# EAGLE design NCP1200 (EAGLE 7.7.0)
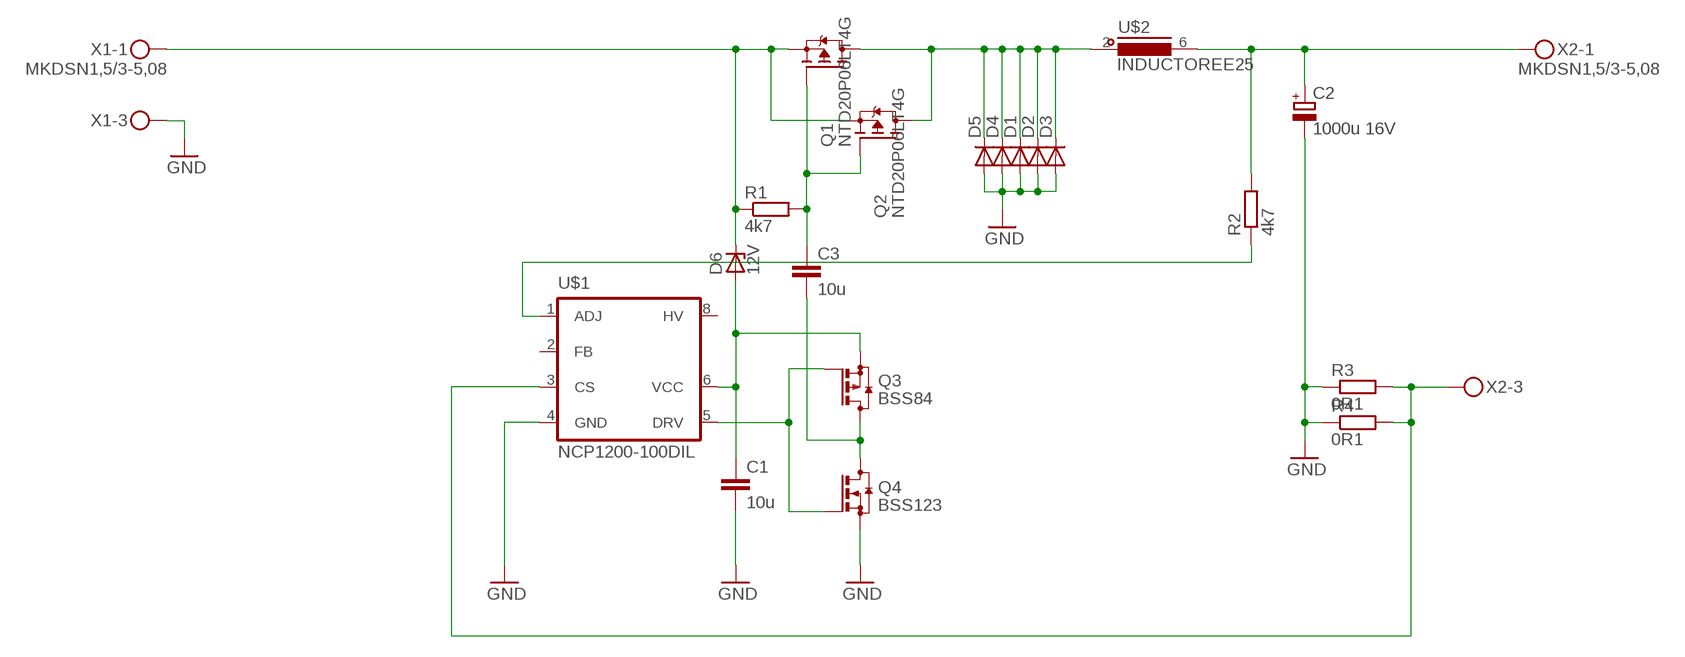
[diagram p0: schematic, sheet 1]

## Parts
C1  10u  C-EUC1210  [C1210]
C2  1000u 16V  CPOL-EUE3.5-8  [E3,5-8]
C3  10u  C-EUC1210  [C1210]
D1  DIODE-DO-214AC  [DO-214AC]
D2  DIODE-DO-214AC  [DO-214AC]
D3  DIODE-DO-214AC  [DO-214AC]
D4  DIODE-DO-214AC  [DO-214AC]
D5  DIODE-DO-214AC  [DO-214AC]
D6  12V  ZENER-DIODESOD80C  [SOD80C]
Q1  NTD20P06LT4G  FDD4141TO252  [TO252]
Q2  NTD20P06LT4G  FDD4141TO252  [TO252]
Q3  BSS84  [SOT23]
Q4  BSS123  [SOT23]
R1  4k7  R-EU_R0805  [R0805]
R2  4k7  R-EU_R0805  [R0805]
R3  0R1  R_SQP-10  [SQP-10]
R4  0R1  R_SQP-10  [SQP-10]
U$1  NCP1200-100DIL  [DIP08]
U$2  INDUCTOREE25  [EE25_8PIN_HORIZ]
X1  MKDSN1,5/3-5,08  [MKDSN1,5/3-5,08]
X2  MKDSN1,5/3-5,08  [MKDSN1,5/3-5,08]

## Nets
GND: C1.2 C2.- D1.A D2.A D3.A D4.A D5.A Q4.2(S) R3.P$1 R4.P$1 U$1.4(GND) X1.3
N$1: D6.C Q1.2(S) Q2.2(S) R1.1 X1.1
N$2: C1.1 D6.A Q3.2(S) U$1.6(VCC)
N$3: D1.C D2.C D3.C D4.C D5.C Q1.3(D) Q2.3(D) U$2.2
N$4: C3.1 Q1.1(G) Q2.1(G) R1.2
N$5: R2.1 U$1.1(ADJ)
N$6: Q3.1(G) Q4.1(G) U$1.5(DRV)
N$7: R3.P$2 R4.P$2 U$1.3(CS) X2.3
N$9: C2.+ R2.2 U$2.6 X2.1
N$10: C3.2 Q3.3(D) Q4.3(D)
Unconnected: U$1.2(FB) U$1.8(HV) X1.2 X2.2

## Library data of the parts
C1 C3 = rcl:C-EU: CAPACITOR, European symbol
C2 = rcl:CPOL-EU: POLARIZED CAPACITOR, European symbol
D1-D5 = diode:DIODE-: DIODE
D6 = diode:ZENER-DIODE: Z-Diode
Q1 Q2 = transistor-fet:FDD4141: P-Channel PowerTrench® MOSFET Source: FDD4141.pdf
Q3 = transistor-small-signal:BSS84: P-CHANNEL MOS FET
Q4 = transistor-small-signal:BSS123: N-CHANNEL MOS FET
R1 R2 = rcl:R-EU_: RESISTOR, European symbol
R3 R4 = Namenlos:R_SQP-10
U$1 = NCP1200:NCP1200-100
U$2 = _Transformers:INDUCTOR
X1 X2 = Namenlos:MKDSN1,5/3-5,08: MKDSN 1,5/ 3-5,08 Printklemme Nennstrom: 13,5 A Nennspannung: 250 V Rastermaß: 5,08 mm Polzahl: 3 Anschlussart: Schraubanschluss Montage: Löten Anschlussrichtung Leiter/Platine: 0 ° Artikelnummer: 1729131 Source: http://eshop.phoenixcontact.com .. 1729131.pdf

## Board
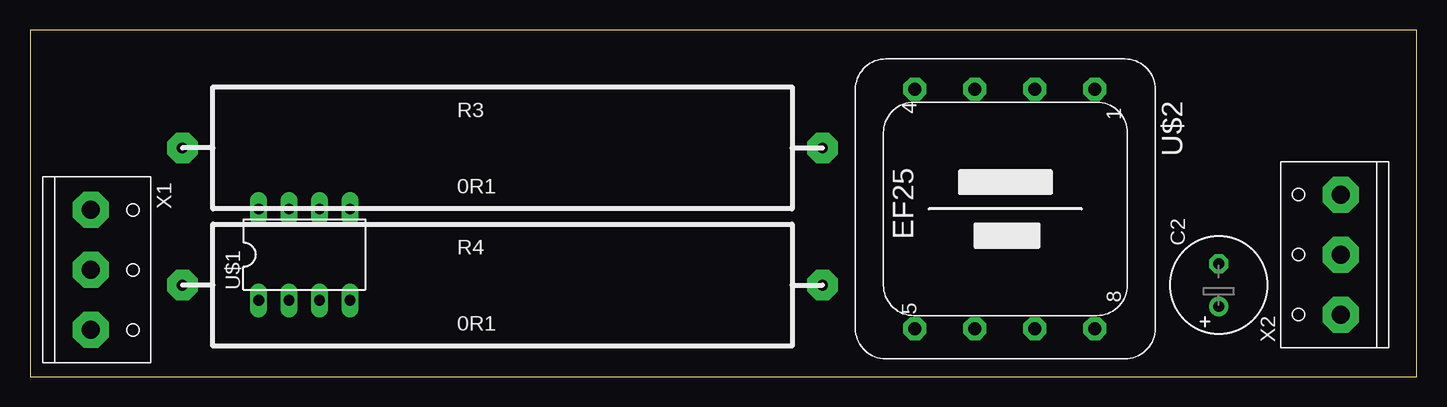
[diagram p1: board, top side]
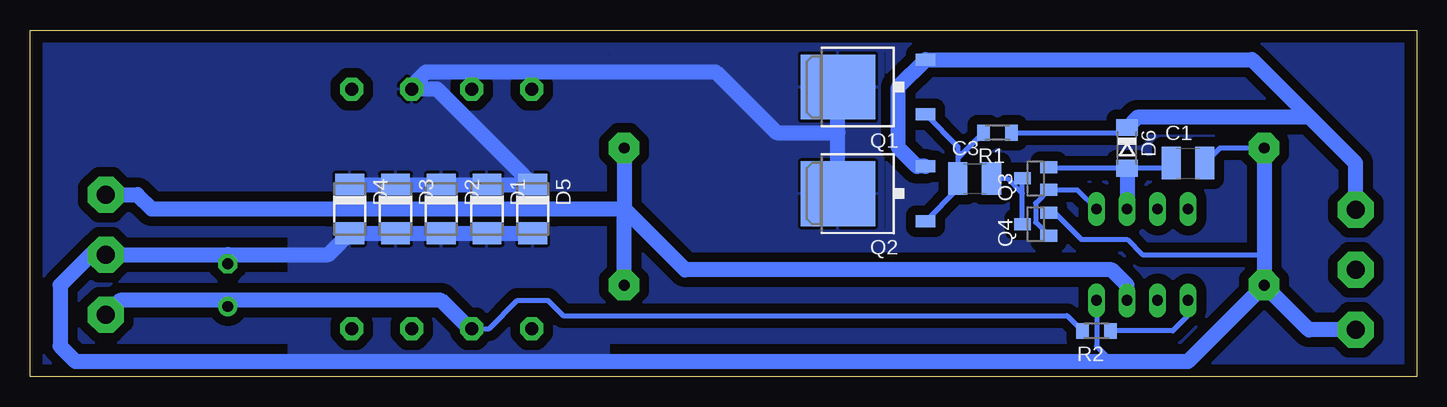
[diagram p2: board, bottom side, seen from below]

Size 115.55 x 28.88 mm. Coordinates in mm from the lower left corner, seen from the top.
Outline: 0,0 115.55,0 115.55,28.88 0,28.88 0,0
Copper layers (1*16): Top 0.035mm / dielectric 1.5mm / Bottom 0.035mm
Design rules "default": minimum track width 10mil, minimum drill 24mil, track to track 8mil, track to pad 8mil, pad to pad 8mil, via to via 8mil, smd to smd 8mil, copper to edge 40mil, drill to drill 8mil, minimum pad ring 10mil, minimum via ring 8mil, stop-mask expansion 4mil, vias tented up to drill 0mil, thermal gap 10mil

### Footprints (pad centres in the part's own frame; a part is rotated, then mirrored left to right if it is on the bottom)
C1210 = smd 1.6 x 2.7: 1 -1.4,0; 2 1.4,0
E3,5-8 = drill 0.9 pad 1.6: + -1.778,0 | drill 0.9 pad 1.6 octagon: - 1.778,0
DO-214AC = smd 1.8 x 2.4: A 2.025,0; C -2.025,0
SOD80C = smd 1.4 x 1.8: A 1.7,0; C -1.7,0
TO252 = smd 1 x 1.6: 1 -2.28,-4.8; 2 2.28,-4.8 | smd 5.4 x 6.2: 3 0,2.5
SOT23 = smd 1 x 1.4: 1 -0.95,-1.1; 2 0.95,-1.1; 3 0,1.1
R0805 = smd 1.05 x 1.3: 1 -1.175,0; 2 1.175,0
SQP-10 = drill 0.9 pad 2.54 octagon: P$1 -26.67,0; P$2 26.67,0
DIP08 = drill 0.9 pad 1.27 long: 1 -2.54,-3.81; 2 0,-3.81; 3 2.54,-3.81; 4 5.08,-3.81; 5 5.08,3.81; 6 2.54,3.81; 7 0,3.81; 8 -2.54,3.81
EE25_8PIN_HORIZ = drill 1.1 pad 1.93 octagon: 1 -9.98,7.46; 2 -9.98,2.46; 3 -9.98,-2.54; 4 -9.98,-7.54; 5 9.98,-7.54; 6 9.98,-2.54; 7 9.98,2.46; 8 9.98,7.46
MKDSN1,5/3-5,08 = drill 1.5 pad 3 octagon: 1 -5,0; 2 0,0; 3 5,0

### Placement (x,y rotation side)
C1  19.05,17.78 0 bottom
C2  99.06,7.62 90 top
C3  36.83,16.51 0 bottom
D1  77.47,13.97 270 bottom
D2  81.28,13.97 270 bottom
D3  85.09,13.97 270 bottom
D4  88.9,13.97 270 bottom
D5  73.66,13.97 270 bottom
D6  24.13,19.05 270 bottom
Q1  45.72,24.13 90 bottom
Q2  45.72,15.24 90 bottom
Q3  31.75,16.51 90 bottom
Q4  31.75,12.7 90 bottom
R1  34.92,20.32 180 bottom
R2  26.67,3.81 180 bottom
R3  39.37,19.05 0 top
R4  39.37,7.62 0 top
U$1  21.59,10.16 0 top
U$2  81.28,13.97 270 top
X1  5.08,8.89 270 top
X2  109.22,10.16 90 top

### Tracks (layer width: path | path; a pad name or v marks a point on that pad's centre or on a via)
GND
  Bottom 0.406: C1.2 16.38,19.05 R3.P$1 | Q4.2 30.16,13.65 27.94,11.43 24.13,11.43 22.86,10.16 12.7,10.16 | U$1.4 26.67,2.54 25.4,1.27 19.05,1.27
  Bottom 1.27: X1.3 8.97,3.89 R4.P$1 | R3.P$1 12.7,10.16 R4.P$1 | D5.A D1.A D2.A D3.A D4.A 90.69,10.16 99.06,10.16 | R4.P$1 19.05,1.27 111.76,1.27 113.03,2.54 113.03,7.62 110.49,10.16 99.06,10.16 | C2.- 99.06,10.16
  pour Bottom (isolate 0.813): 67.31,12.7 93.98,12.7 93.98,0 67.31,0
N$1
  Bottom 0.406: R1.1 24.56,20.32 D6.C
  Bottom 1.27: X1.1 5.08,17.78 8.89,21.59 | 8.89,21.59 23.29,21.59 D6.C | 8.89,21.59 13.71,26.41 Q1.2 43.18,24.15 43.18,19.05 41.65,17.52 Q2.2
N$2
  Bottom 0.406: Q3.2 30.54,17.35 D6.A 20.88,17.35 C1.1
  Bottom 1.27: D6.A U$1.6
N$3
  Bottom 1.27: Q2.3 48.22,20.32 | 48.22,20.32 Q1.3 | D4.C D3.C D2.C D1.C D5.C 81.61,23.95 U$2.2 83.74,24.21 82.55,25.4 58.42,25.4 53.34,20.32 48.22,20.32
  pour Bottom (isolate 0.813): 44.45,10.16 44.45,27.94 66.04,27.94 67.31,26.67 67.31,11.43 66.04,10.16
  pour Bottom (isolate 0.813): 67.31,15.24 67.31,26.67 68.58,27.94 114.3,27.94 114.3,16.51 113.03,15.24
N$4
  Bottom 0.406: R1.2 38.23,18.19 | 38.23,18.19 C3.1 38.23,15.65 Q2.1 | Q1.1 38.23,19.16 38.23,18.19
N$5
  Bottom 0.406: 19.14,6.45 19.14,4.99 20.32,3.81 R2.1
  Bottom 1.27: 19.14,6.45 U$1.1
N$6
  Bottom 0.406: U$1.5 28.26,15.56 Q3.1 31.75,14.46 31.75,12.85 Q4.1
N$7
  Bottom 1.27: 66.04,13.97 60.96,8.89 25.4,8.89 24.13,7.62 U$1.3 | R4.P$2 66.04,13.97 | R3.P$2 66.04,13.97 | X2.3 106.6,15.16 105.41,13.97 66.04,13.97
N$8
  pour Bottom (isolate 0.813): 0,29.21 115.57,29.21 115.57,0 0,0
N$9
  Bottom 0.406: U$2.6 77.29,3.99 74.93,6.35 72.39,6.35 71.12,5.08 29.11,5.08 R2.2
  Bottom 1.27: U$2.6 78.92,3.99 81.28,6.35 99.06,6.35 | 99.06,6.35 108.03,6.35 X2.1 | C2.+ 99.06,6.35
N$10
  Bottom 0.406: Q4.3 32.85,15.24 | 32.85,15.24 Q3.3 | C3.2 34.12,16.51 32.85,15.24